# Altium schematic sheet Frequency_Analog.SchDoc
size A4; SheetNumber: 4; SheetTotal: 11
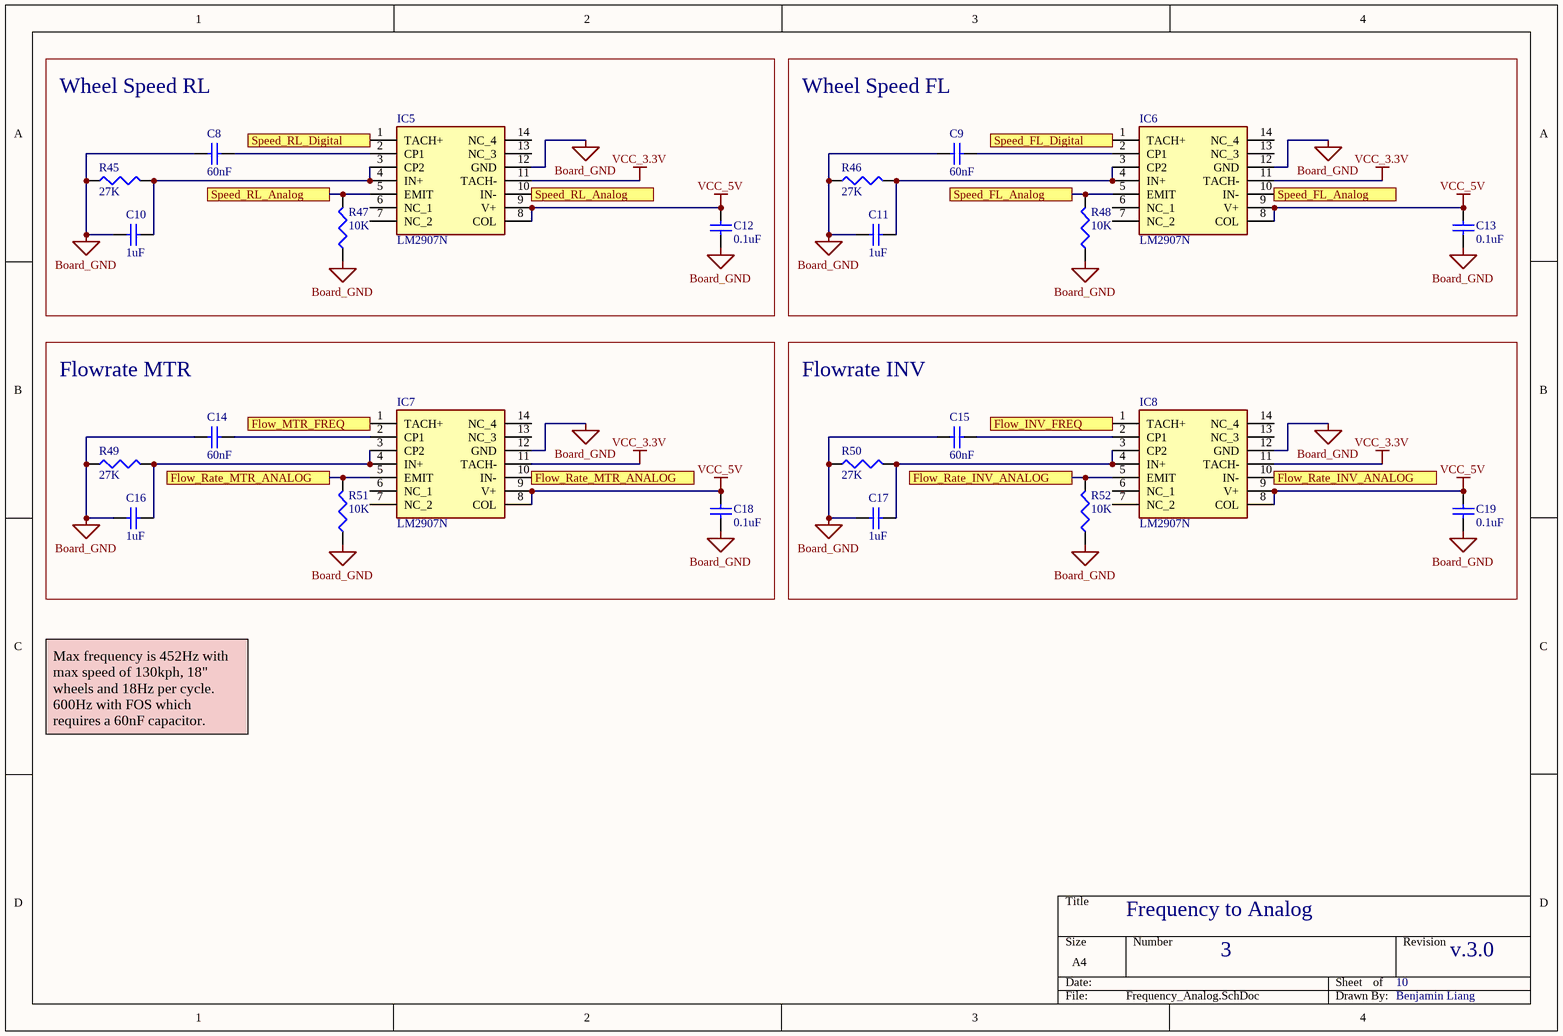
[diagram p0: Frequency_Analog.SchDoc]

## Parts
C8  60nF  [C1206]
C9  60nF  [C1206]
C10  1uF  [C1206]
C11  1uF  [C1206]
C12  0.1uF  [C1206]
C13  0.1uF  [C1206]
C14  60nF  [C1206]
C15  60nF  [C1206]
C16  1uF  [C1206]
C17  1uF  [C1206]
C18  0.1uF  [C1206]
C19  0.1uF  [C1206]
IC5  LM2907N  [DIP825W45P254L1905H9015Q14]
IC6  LM2907N  [DIP825W45P254L1905H9015Q14]
IC7  LM2907N  [DIP825W45P254L1905H9015Q14]
IC8  LM2907N  [DIP825W45P254L1905H9015Q14]
R45  27K  [J1-0603]
R46  27K  [J1-0603]
R47  10K  [J1-0603]
R48  10K  [J1-0603]
R49  27K  [J1-0603]
R50  27K  [J1-0603]
R51  10K  [J1-0603]
R52  10K  [J1-0603]

## Blocks framed on the sheet
Wheel Speed RL: C8 C10 C12 IC5 R45 R47
Wheel Speed FL: C9 C11 C13 IC6 R46 R48
Flowrate MTR: C14 C16 C18 IC7 R49 R51
Flowrate INV: C15 C17 C19 IC8 R50 R52

## Ports
Flow_INV_FREQ, Flow_MTR_FREQ, Flow_Rate_INV_ANALOG, Flow_Rate_MTR_ANALOG, Speed_FL_Analog, Speed_FL_Digital, Speed_RL_Analog, Speed_RL_Digital

## Nets
Board_GND: C8.2 C9.2 C10.2 C11.2 C12.2 C13.2 C14.2 C15.2 C16.2 C17.2 C18.2 C19.2 IC5.12(GND) IC6.12(GND) IC7.12(GND) IC8.12(GND) R45.1 R46.1 R47.1 R48.1 R49.1 R50.1 R51.1 R52.1
VCC_3.3V: IC5.11(TACH-) IC6.11(TACH-) IC7.11(TACH-) IC8.11(TACH-)
VCC_5V: C12.1 C13.1 C18.1 C19.1 IC5.8(COL) IC5.9(V+) IC6.8(COL) IC6.9(V+) IC7.8(COL) IC7.9(V+) IC8.8(COL) IC8.9(V+)
Flow_INV_FREQ: IC8.1(TACH+) ; port Flow_INV_FREQ
Flow_MTR_FREQ: IC7.1(TACH+) ; port Flow_MTR_FREQ
Flow_Rate_INV_ANALOG: IC8.5(EMIT) IC8.10(IN-) R52.2 ; port Flow_Rate_INV_ANALOG
Flow_Rate_MTR_ANALOG: IC7.5(EMIT) IC7.10(IN-) R51.2 ; port Flow_Rate_MTR_ANALOG
Speed_FL_Analog: IC6.5(EMIT) IC6.10(IN-) R48.2 ; port Speed_FL_Analog
Speed_FL_Digital: IC6.1(TACH+) ; port Speed_FL_Digital
Speed_RL_Analog: IC5.5(EMIT) IC5.10(IN-) R47.2 ; port Speed_RL_Analog
Speed_RL_Digital: IC5.1(TACH+) ; port Speed_RL_Digital
NetC8_1: C8.1 IC5.2(CP1)
NetC9_1: C9.1 IC6.2(CP1)
NetC10_1: C10.1 IC5.3(CP2) IC5.4(IN+) R45.2
NetC11_1: C11.1 IC6.3(CP2) IC6.4(IN+) R46.2
NetC14_1: C14.1 IC7.2(CP1)
NetC15_1: C15.1 IC8.2(CP1)
NetC16_1: C16.1 IC7.3(CP2) IC7.4(IN+) R49.2
NetC17_1: C17.1 IC8.3(CP2) IC8.4(IN+) R50.2

Not connected (* = marked no-connect by the designer): IC5 6(NC_1) 7(NC_2) 13(NC_3) 14(NC_4); IC6 6(NC_1) 7(NC_2) 13(NC_3) 14(NC_4); IC7 6(NC_1) 7(NC_2) 13(NC_3) 14(NC_4); IC8 6(NC_1) 7(NC_2) 13(NC_3) 14(NC_4)

## Notes on the sheet
- Max frequency is 452Hz with max speed of 130kph, 18" wheels and 18Hz per cycle. 600Hz with FOS which requires a 60nF capacitor.
- Frequency to Analog
- 3
- 10
- v.3.0
- Benjamin Liang

## Library data of the parts
C8-C19 = Cap Semi: Capacitor (Semiconductor SIM Model); Value: 100nF; Published: 8-Jun-2000; LatestRevisionDate: 29-May-2009; LatestRevisionNote: IPC-7351 Footprint Added.; PackageReference: C1206; Publisher: Altium Limited; PackageDescription: Chip Capacitor
IC5-IC8 = LM2907N: Integrated Circuit; Manufacturer_Name: Texas Instruments; Datasheet Link: https://www.ti.com/lit/ds/symlink/lm2907-n.pdf?ts=1629619091467&ref_url=https%253A%252F%252Fwww.google.com%252F; Height: 5.334mm; Manufacturer_Part_Number: LM2907N; Mouser Part Number: 926-LM2907N; Mouser Price/Stock: https://www.mouser.co.uk/ProductDetail/Texas-Instruments/LM2907N?qs=X1J7HmVL2ZGG77PtYOUT4A%3D%3D
R45 R46 R49 R50 = Res3: Resistor; Value: 10K; Published: 8-Jun-2000; LatestRevisionDate: 29-May-2009; LatestRevisionNote: IPC-7351 Footprint Added.; PackageReference: J1-0603; Publisher: Altium Limited; PackageDescription: Chip Resistor
R47 R48 R51 R52 = Res3: Resistor; Published: 8-Jun-2000; LatestRevisionDate: 29-May-2009; LatestRevisionNote: IPC-7351 Footprint Added.; PackageReference: J1-0603; Publisher: Altium Limited; PackageDescription: Chip Resistor; Value: 10K